# EAGLE schematic Audio Bord (EAGLE 9.6.2)
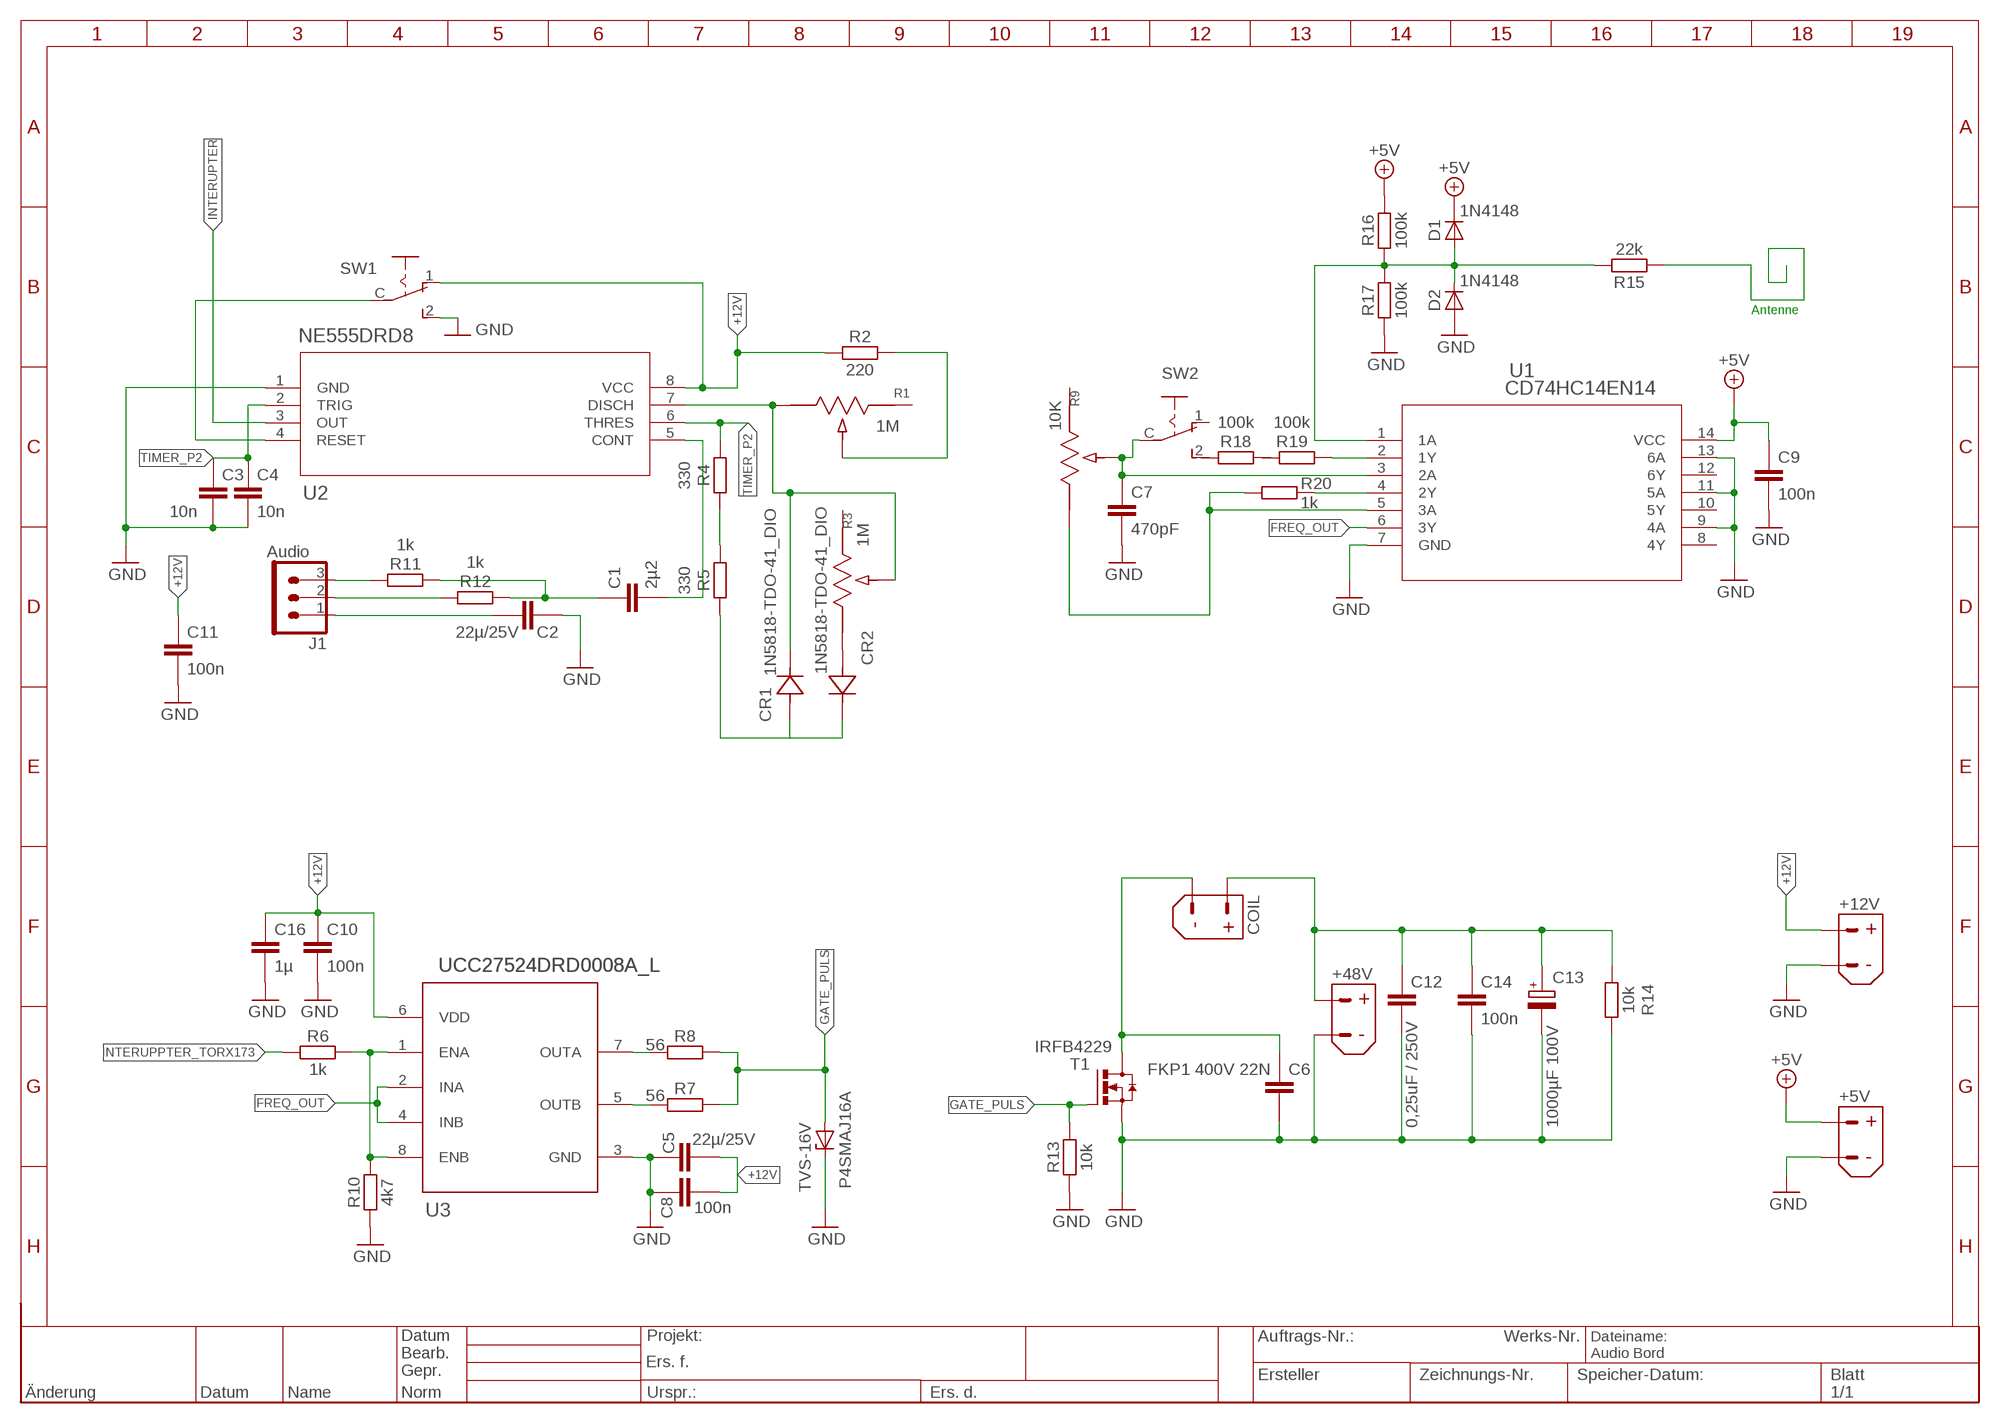
[diagram p0: schematic, sheet 1]
FRAME1 (RAHMEN_A4_8Z-19S): BOM_IGNORE: 1

## Parts
+5V  XT60UPB-M  [XT60UPB-M]
+12V  XT60UPB-M  [XT60UPB-M]
+48V  XT60UPB-M  [XT60UPB-M]
C1  2µ2  C-EU_2U2-C1206  [C1206]
C2  22µ/25V  C-EU_22U-25V-C1206  [C1206]
C3  10n  C-EU_10N-C0603  [C0603]
C4  10n  C-EU_10N-C0603  [C0603]
C5  22µ/25V  C-EU_22U-25V-C1206  [C1206]
C6  FKP1 400V 22N  C-EU_C1206  [C1206]
C7  470pF  C-EU_C1206  [C1206]
C8  100n  C-EU_100N-C1206  [C1206]
C9  100n  C-EU_100N-C1206  [C1206]
C10  100n  C-EU_100N-C1206  [C1206]
C11  100n  C-EU_100N-C1206  [C1206]
C12  0,25uF / 250V  C-EU_C1206  [C1206]
C13  1000µF 100V  CPOL-EU_E2-5  [E2-5]
C14  100n  C-EU_100N-C1206  [C1206]
C16  1µ  C-EU_1U-C1206  [C1206]
COIL  XT60UPB-M  [XT60UPB-M]
CR1  1N5818-TDO-41_DIO  [DO-41_DIO]
CR2  1N5818-TDO-41_DIO  [DO-41_DIO]
D1  1N4148  DIODE-1N4148-SOD523  [SOD523]
D2  1N4148  DIODE-1N4148-SOD523  [SOD523]
J1  Audio  PSS-1X3G  [PSS-03G]
P4SMAJ16A  TVS-16V  Z-DIODE-TSV-16V-DO214AC  [DO214AC/SMA]
R1  1M  3296X-1-102LFPOT_3296X  [POT_3296X]
R2  220  R-EU_220-R1206  [R1206]
R3  1M  3296X-1-102LFPOT_3296X  [POT_3296X]
R4  330  R-EU_330-R0805  [R0805]
R5  330  R-EU_330-R0805  [R0805]
R6  1k  R-EU_1K-R1206  [R1206]
R7  56  R-EU_56-R1206  [R1206]
R8  56  R-EU_56-R1206  [R1206]
R9  10K  3296X-1-102LFPOT_3296X  [POT_3296X]
R10  4k7  R-EU_4K7-R1206  [R1206]
R11  1k  R-EU_1K-R1206  [R1206]
R12  1k  R-EU_1K-R1206  [R1206]
R13  10k  R-EU_10K-R1206  [R1206]
R14  10k  R-EU_10K-R1206  [R1206]
R15  22k  R-EU_22K-R1206  [R1206]
R16  100k  R-EU_100K-R1206  [R1206]
R17  100k  R-EU_100K-R1206  [R1206]
R18  100k  R-EU_100K-R1206  [R1206]
R19  100k  R-EU_100K-R1206  [R1206]
R20  1k  R-EU_1K-R1206  [R1206]
SW1  SW_SPDT_ESP10  [ESP10XX]
SW2  SW_SPDT_ESP10  [ESP10XX]
T1  IRFB4229  IPB020N10N5  [PG-TO263-3]
U1  CD74HC14EN14  [N14]
U2  NE555DRD8  [D8]
U3  UCC27524DRD0008A_L  [D0008A_L]

## Nets
+5V: +5V.+ C9.1 D1.C R16.2 U1.14(VCC)
+12V: +12V.+ C5.2 C8.2 C10.1 C11.1 C16.1 R2.1 SW1.1(NC) U2.8(VCC) U3.6(VDD)
FREQ_OUT: U1.6(3Y) U3.2(INA) U3.4(INB)
GATE_PULS: P4SMAJ16A.A R7.2 R8.2 R13.2 T1.1(G)
GND: +5V.- +12V.- +48V.- C2.2 C3.2 C4.2 C5.1 C6.2 C7.2 C8.1 C9.2 C10.2 C11.2 C12.2 C13.- C14.2 C16.2 D2.A P4SMAJ16A.C R10.1 R13.1 R14.1 R17.1 SW1.2(NO) T1.3(S) U1.7(GND) U1.9(4A) U1.11(5A) U1.13(6A) U2.1(GND) U3.3(GND)
INTERUPPTER_TORX173: R6.1
INTERUPTER: U2.3(OUT)
N$1: CR1.1 R1.3 R3.2 U2.7(DISCH)
N$2: R1.2 R2.2
N$3: R19.2 U1.2(1Y)
N$4: R4.1 R5.2
N$5: CR1.2 CR2.1 R5.1
N$6: C1.2 U2.5(CONT)
N$8: R8.1 U3.7(OUTA)
N$9: R7.1 U3.5(OUTB)
N$12: C6.1 COIL.- T1.4(D)
N$13: R9.3 R20.1 U1.5(3A)
N$14: J1.2 R12.1
N$15: C2.1 J1.1
N$16: CR2.2 R3.3
N$17: +48V.+ C12.1 C13.+ C14.1 COIL.+ R14.2
N$18: C1.1 R11.2 R12.2
N$19: J1.3 R11.1
N$20: R15.1
N$21: D1.A D2.C R15.2 R16.1 R17.2 U1.1(1A)
N$22: C7.1 R9.2 SW2.C U1.3(2A)
N$23: R20.2 U1.4(2Y)
N$110: SW1.C U2.4(RESET)
TIMER_P2: C3.1 C4.1 R4.2 U2.2(TRIG) U2.6(THRES)
UCC_P1: R6.2 R10.2 U3.1(ENA) U3.8(ENB)
Unconnected: R1.1 R3.1 R9.1 R18.1 R18.2 R19.1 SW2.1(NC) SW2.2(NO) U1.8(4Y) U1.10(5Y) U1.12(6Y)

## Notes on the sheet
- Antenne

## Library data of the parts
+5V +12V +48V COIL = 1_Robo-Connect:XT60?-M: AMASS Akku-Connector Datasheets: https://ragm.cc/qu7Q7; BOM_FORCEGROUP: 1; DATASHEET: https://ragm.cc/njzOS; OC_TME: XT60UPB-M
C1 = 1_Robo-Passiv:C-EU_*-?: CAPACITOR, European symbol Datasheets <https://ragm.cc/bi0DA>; DATASHEET: https://ragm.cc/bi0DA; OC_MOUSER: 187-CL31B225KOHNNNE; OC_REICHELT: C1206C225K4RAC7800
C2 C5 = 1_Robo-Passiv:C-EU_*-?: CAPACITOR, European symbol Datasheets <https://ragm.cc/bi0DA>; DATASHEET: https://ragm.cc/bi0DA; OC_MOUSER: 187-CL31A226KAHNNNE
C3 C4 = 1_Robo-Passiv:C-EU_*-?: CAPACITOR, European symbol Datasheets <https://ragm.cc/bi0DA>; DATASHEET: https://ragm.cc/bi0DA; OC_MOUSER: 80-C0603C103J5RAUTO; OC_REICHELT: GRM1885C1H103J
C6 C7 C12 = 1_Robo-Passiv:C-EU: <check-lbr error-oc="skip"/> CAPACITOR, European symbol; DATASHEET: https://ragm.cc/bi0DA
C8-C11 C14 = 1_Robo-Passiv:C-EU_*-?: CAPACITOR, European symbol Datasheets <https://ragm.cc/bi0DA>; DATASHEET: https://ragm.cc/bi0DA; OC_CONRAD: 445273 - 62; OC_FARNELL: 718646; OC_MOUSER: 603-CC206KRX7R9BB104; OC_REICHELT: X7R-G1206 100N
C13 = 1_Robo-Passiv:CPOL-EU: <check-lbr error-oc="skip"/> POLARIZED CAPACITOR, European symbol; DATASHEET: https://ragm.cc/6vz9Y
C16 = 1_Robo-Passiv:C-EU_*-?: CAPACITOR, European symbol Datasheets <https://ragm.cc/bi0DA>; DATASHEET: https://ragm.cc/bi0DA; OC_REICHELT: KEM X7R1206 1,0U
CR1 CR2 = 1N5818:1N5818-T; COPYRIGHT: Copyright (C) 2026 Ultra Librarian. All rights reserved.; MANUFACTURER_NAME: Diodes Inc; MANUFACTURER_PART_NUMBER: 1N5818-T
D1 D2 = 1_Robo-Diode:DIODE-*-?: DIODE, predefined value Datasheets <https://ragm.cc/vPcmw>; DATASHEET: https://ragm.cc/AoSMn; OC_FARNELL: 1773531; OC_MOUSER: 621-1N4148WT; OC_REICHELT: 1N 4148WT7 DII
J1 = 1_Robo-Connect:PSS-1X3: <check-lbr error-datasheet="dev" error-datasheet-skip="PSS-1X3SMD"/> PSS - PIN HEADER; BOM_FORCEGROUP: 1; DATASHEET: https://ragm.cc/S04Zo; OC_REICHELT: PS 25/3G WS
P4SMAJ16A = 1_Robo-Diode:Z-DIODE-*-?: Z-DIODE, predefined value Datasheets <https://ragm.cc/IO813>; DATASHEET: https://ragm.cc/x4LKa; OC_FARNELL: 1843352; OC_MOUSER: 637-P4SMAJ16A; OC_REICHELT: P4SMAJ16A
R1 R3 R9 = Poti_1M:3296X-1-102LF; COPYRIGHT: Copyright (C) 2026 Ultra Librarian. All rights reserved.; MANUFACTURER_NAME: Bourns Electronics; MANUFACTURER_PART_NUMBER: 3296X-1-102LF
R2 = 1_Robo-Passiv:R-EU_*-?: RESISTOR, European symbol Datasheets <https://ragm.cc/ogWDb>; DATASHEET: https://ragm.cc/ogWDb; OC_MOUSER: 603-RC1206JR-07220RL; OC_REICHELT: SMD 1/4W 220
R4 R5 = 1_Robo-Passiv:R-EU_*-?: RESISTOR, European symbol Datasheets <https://ragm.cc/ogWDb>; DATASHEET: https://ragm.cc/ogWDb; OC_CONRAD: 1584487 - 62; OC_MOUSER: RC0805JR-07330RL; OC_REICHELT: SMD-0805 330
R6 R11 R12 R20 = 1_Robo-Passiv:R-EU_*-?: RESISTOR, European symbol Datasheets <https://ragm.cc/ogWDb>; DATASHEET: https://ragm.cc/ogWDb; OC_CONRAD: 1584217 - 62; OC_FARNELL: 9240527; OC_MOUSER: 603-RC1206JR-071KL; OC_REICHELT: SMD 1/4W 1,0K
R7 R8 = 1_Robo-Passiv:R-EU_*-?: RESISTOR, European symbol Datasheets <https://ragm.cc/ogWDb>; DATASHEET: https://ragm.cc/ogWDb; OC_CONRAD: 2889520 - 62; OC_MOUSER: 603-RC1206JR-7W56RL; OC_REICHELT: SMD 1/4W 56
R10 = 1_Robo-Passiv:R-EU_*-?: RESISTOR, European symbol Datasheets <https://ragm.cc/ogWDb>; DATASHEET: https://ragm.cc/ogWDb; OC_CONRAD: 1585382 - 62; OC_FARNELL: 9240608; OC_MOUSER: 603-RC1206JR-074K7L; OC_REICHELT: SMD 1/4W 4,7k
R13 R14 = 1_Robo-Passiv:R-EU_*-?: RESISTOR, European symbol Datasheets <https://ragm.cc/ogWDb>; DATASHEET: https://ragm.cc/ogWDb; OC_CONRAD: 1585388 - 62; OC_FARNELL: 9240640; OC_MOUSER: 603-RC1206JR-0710KL; OC_REICHELT: SMD 1/4W 10k
R15 = 1_Robo-Passiv:R-EU_*-?: RESISTOR, European symbol Datasheets <https://ragm.cc/ogWDb>; DATASHEET: ogWDb; OC_MOUSER: 603-RC1206JR-0722KL; OC_REICHELT: SMD 1/4W 22k
R16-R19 = 1_Robo-Passiv:R-EU_*-?: RESISTOR, European symbol Datasheets <https://ragm.cc/ogWDb>; DATASHEET: https://ragm.cc/ogWDb; OC_CONRAD: 1585396 - 62; OC_FARNELL: 9240764; OC_MOUSER: 603-RC1206JR-07100KL; OC_REICHELT: SMD 1/4W 100k
SW1 SW2 = 1_Robo-Switch:SW_SPDT: Single Pole, Double Throw - latching Switch Datasheets <https://ragm.cc/3ZYBy>; BOM_FORCEGROUP: 1; DATASHEET: https://ragm.cc/KXeOY; OC_REICHELT: SS ESP101
T1 = 1_Robo-Transistor:IPB020N10N5: N-Channel MOSFET IPB020N10N5 OptiMOS™5 Power-Transistor, 100 V Optimized for FOMOSS 175°C rated Ideal for high-frequency switching and synchronous rectification; DATASHEET: https://ragm.cc/8bqt9; OC_MOUSER: 726-IPB020N10N5
U1 = 74HC14:CD74HC14E; COPYRIGHT: Copyright (C) 2026 Ultra Librarian. All rights reserved.; DATASHEET: https://www.ti.com/lit/gpn/cd74hc14; DESCRIPTION: 6-ch, 2-V to 6-V inverters with Schmitt-Trigger inputs 14-PDIP -55 to 125; MANUFACTURER_NAME: Texas Instruments; MANUFACTURER_PART_NUMBER: CD74HC14E
U2 = NE555:NE555DR; COPYRIGHT: Copyright (C) 2026 Ultra Librarian. All rights reserved.; DATASHEET: https://www.ti.com/lit/gpn/ne555; DESCRIPTION: Single Precision Timer 8-SOIC 0 to 70; MANUFACTURER_NAME: Texas Instruments; MANUFACTURER_PART_NUMBER: NE555DR
U3 = UCC27524:UCC27524DR; COPYRIGHT: Copyright (C) 2026 Ultra Librarian. All rights reserved.; DATASHEET: https://www.ti.com/lit/gpn/ucc27524; DESCRIPTION: 20V VDD, 5A/5A dual-channel low-side gate driver with 4V UVLO and -5V input capability 8-SOIC -40 to 140; MANUFACTURER_NAME: Texas Instruments; MANUFACTURER_PART_NUMBER: UCC27524DR; REFDES: RefDes; TYPE: TYPE